# EAGLE design RTC-Module (EAGLE 7.7.0)
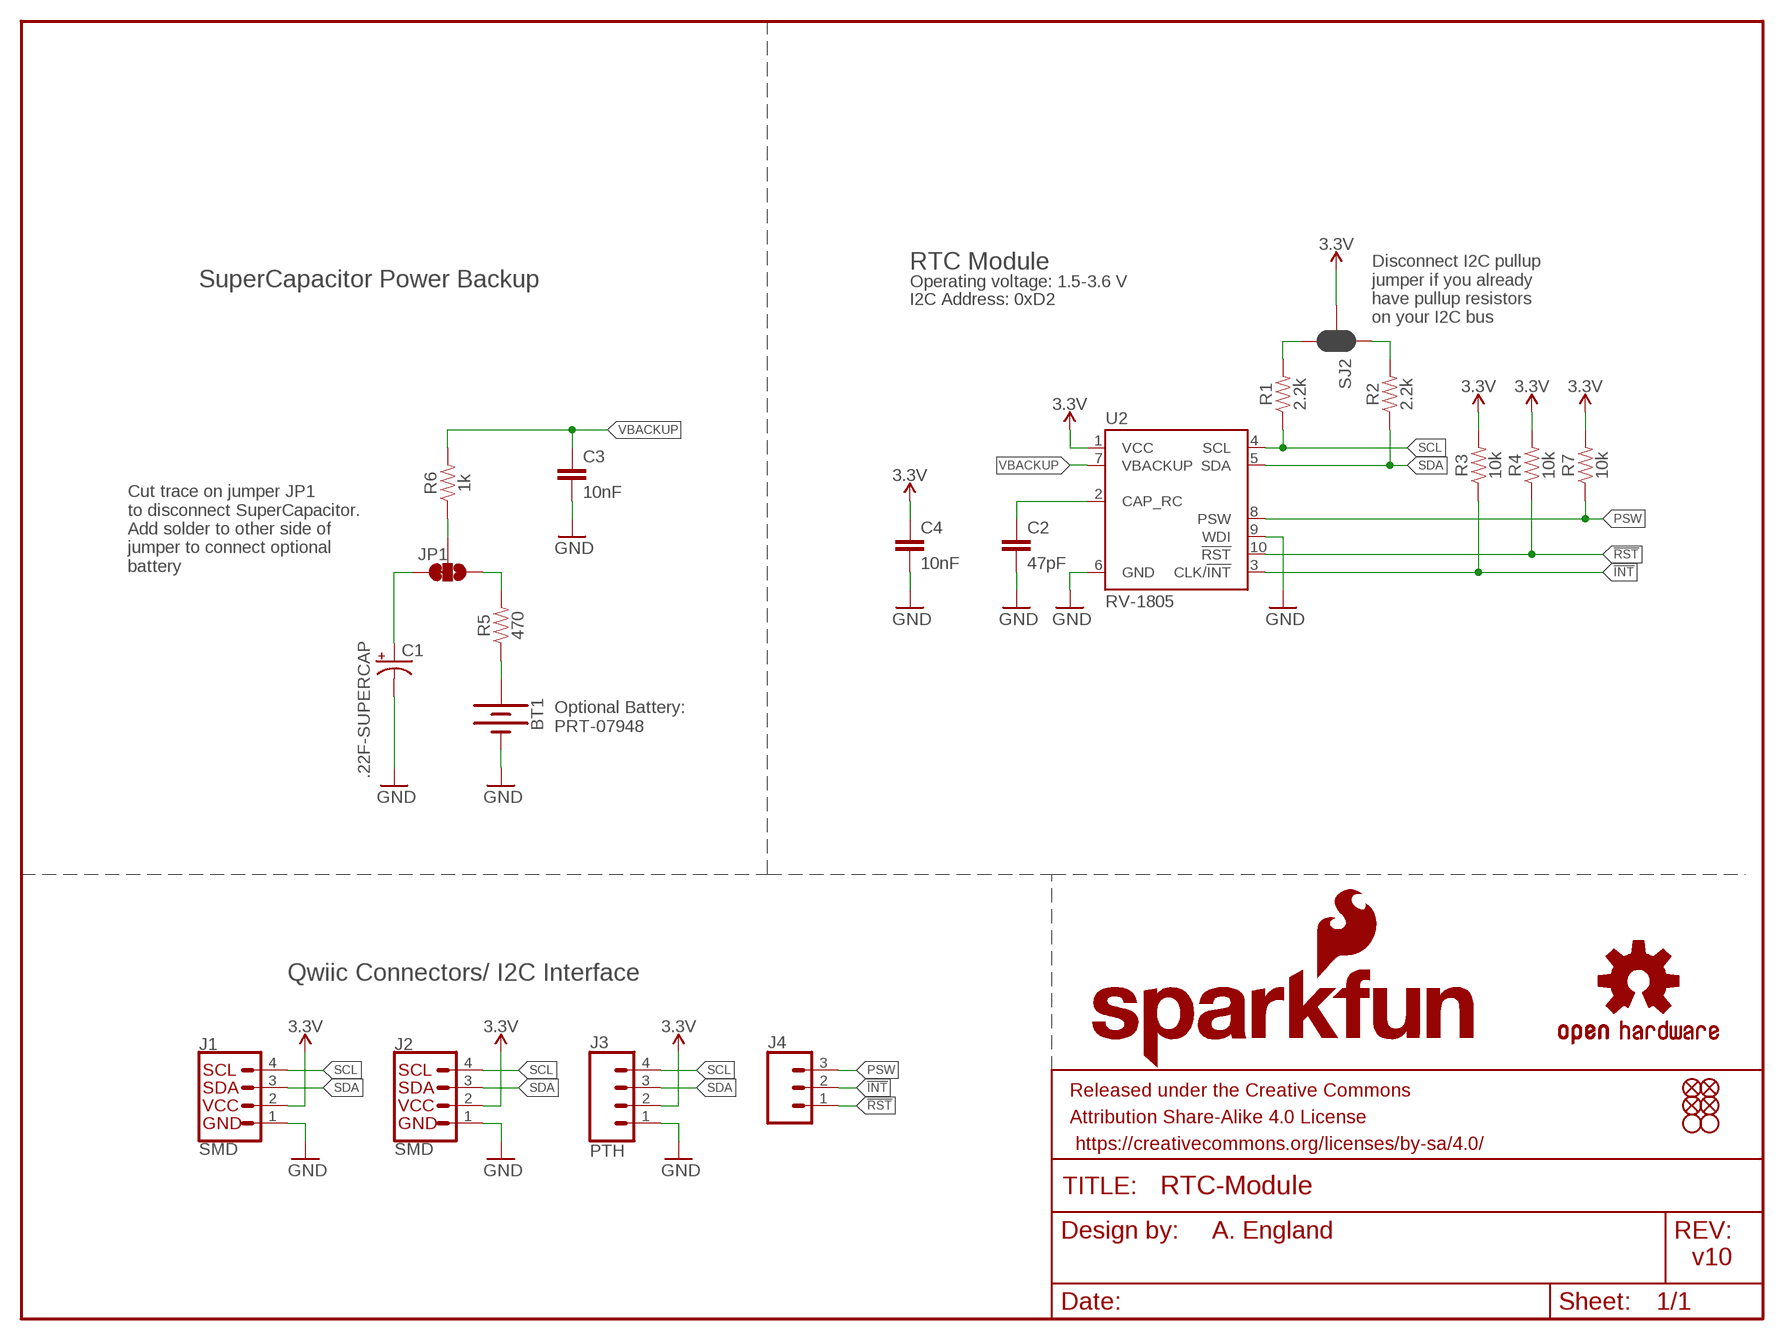
[diagram p0: schematic, sheet 1]

## Parts
BT1  BATTERY-12MM_PTH  [BATTCON_12MM_PTH]
C1  .22F-SUPERCAP  [DSK-RADIAL-6.8MM]
C2  47pF  47PF-0603-50V-5%  [0603]
C3  10nF  10NF-0603-50V-10%  [0603]
C4  10nF  10NF-0603-50V-10%  [0603]
FD1  FIDUCIALUFIDUCIAL  [FIDUCIAL-MICRO]
FD2  FIDUCIALUFIDUCIAL  [FIDUCIAL-MICRO]
FD3  FIDUCIALUFIDUCIAL  [FIDUCIAL-MICRO]
FD4  FIDUCIALUFIDUCIAL  [FIDUCIAL-MICRO]
FRAME2  FRAME-LETTER  [CREATIVE_COMMONS]
J1  SMD  QWIIC_CONNECTORJS-1MM  [1X04_1MM_RA]
J2  SMD  QWIIC_CONNECTORJS-1MM  [1X04_1MM_RA]
J3  PTH  CONN_041X04_NO_SILK  [1X04_NO_SILK]
J4  CONN_031X03_NO_SILK  [1X03_NO_SILK]
JP1  JUMPER-SMT_3_1-NC_TRACE_NO-SILK  [SMT-JUMPER_3_1-NC_TRACE_NO-SILK]
LOGO1  OSHW-LOGOS  [OSHW-LOGO-S]
LOGO2  SFE_LOGO_NAME_FLAME.1_INCH  [SFE_LOGO_NAME_FLAME_.1]
LOGO3  SFE_LOGO_NAME_FLAME.1_INCH  [SFE_LOGO_NAME_FLAME_.1]
R1  2.2k  2.2KOHM-0603-1/10W-1%  [0603]
R2  2.2k  2.2KOHM-0603-1/10W-1%  [0603]
R3  10k  10KOHM-0603-1/10W-1%  [0603]
R4  10k  10KOHM-0603-1/10W-1%  [0603]
R5  470  470OHM-0603-1/10W-1%  [0603]
R6  1k  1KOHM-0603-1/10W-1%  [0603]
R7  10k  10KOHM-0603-1/10W-1%  [0603]
SJ2  JUMPER-SMT_3_2-NC_PASTE_SILK  [SMT-JUMPER_3_2-NC_PASTE_SILK]
U2  RV-1805  [RV-1805]
U$6  STAND-OFF  [STAND-OFF]
U$7  STAND-OFF  [STAND-OFF]

## Nets
3.3V: C4.1 J1.2 J2.2 J3.2 R3.2 R4.2 R7.2 SJ2.2 U2.1(VCC)
!INT: J4.2 R3.1 U2.3(CLK/!INT)
!RST: J4.1 R4.1 U2.10(!RST)
GND: BT1.GND(-) C1.- C2.2 C3.2 C4.2 J1.1 J2.1 J3.1 U2.6(GND) U2.9(WDI)
N$1: R1.2 SJ2.3
N$2: R2.2 SJ2.1
N$3: BT1.VCC@1(+) R5.1
N$4: C2.1 U2.2(CAP_RC)
N$5: JP1.2 R6.1
N$6: C1.+ JP1.3
N$7: JP1.1 R5.2
PSW: J4.3 R7.1 U2.8(PSW)
SCL: J1.4 J2.4 J3.4 R1.1 U2.4(SCL)
SDA: J1.3 J2.3 J3.3 R2.1 U2.5(SDA)
VBACKUP: C3.1 R6.2 U2.7(VBACKUP)

## Notes on the sheet
- RTC Module
- SuperCapacitor Power Backup | Operating voltage: 1.5-3.6 V
- I2C Address: 0xD2
- Disconnect I2C pullup 
  jumper if you already 
  have pullup resistors 
  on your I2C bus
- Cut trace on jumper JP1 
  to disconnect SuperCapacitor.
  Add solder to other side of 
  jumper to connect optional
  battery
- Optional Battery: 
  PRT-07948
- Qwiic Connectors/ I2C Interface
- A. England
- v10

## Library data of the parts
BT1 = Andy:BATTERY: Battery - Single Cell A variety of battery chemistries, sizes, and footprints. Device List: 20MM_PTH - Coin Cell Battery Holder - 20mm (PTH) <https://www.sparkfun.com/products/783> 6.8MM_PTH - Coin Cell Battery Holder - 6.8MM(SMD) <https://www.digikey.com/product-detail/en/seiko-instruments/MS621FE-FL11E/728-1057-ND/1889208?WT.srch=1&gclid=CNOQ5a6LzdQCFZS2wAodXCkE0g> 12MM_SMD - Coin Cell Battery Holder - 12mm (SMD) <https://www.sparkfun.com/products/10592> 12MM_PTH - Coin Cell Battery Holder - 12mm (PTH) <https://www.sparkfun.com/products/7948> 20MM_SMD - 20mm Coin Cell Battery Holder (SMD) (2 legs) Used on the Big Time Watch Kit <https://www.sparkfun.com/products/11734> 20MM_SMD_4LEGS - Coin Cell Battery Holder - 20mm (SMD) <https://www.sparkfun.com/products/11892> 20MM_SMD_4LEGS_OVERPASTE - Coin Cell Battery Holder - 20mm (SMD) <https://www.sparkfun.com/products/11892> (Over-paste on the legs) 24.5MM_PTH - Coin Cell Battery Holder - 24.5mm (PTH) <https://www.sparkfun.com/products/8863> 9V - 9V Battery Holder - PC Mount Used on the SparkFun SparkPunk Sound Kit <https://www.sparkfun.com/products/11177> and SparkFun SparkPunk Sequencer Kit <https://www.sparkfun.com/products/12707> 18650 - Battery Holder - 18650 (PTH) <https://www.sparkfun.com/products/13113> AA - Battery Holder - 1xAA (PTH) <https://www.sparkfun.com/products/7949> AAA - Battery Holder - 1xAAA (PTH) <https://www.sparkfun.com/products/12718> AA_KIT - Battery Holder - 1xAA (PTH) <https://www.sparkfun.com/products/7949> Special kit package - pads only have exposed copper on one side of the board. AAA_KIT - Battery Holder - 1xAAA (PTH) <https://www.sparkfun.com/products/12718> Special kit package - pads only have exposed copper on one side of the board.; PROD_ID: BATT-08315; SF_SKU: PRT-07948
C1 = SparkFun-Capacitors:.22F-SUPERCAP: ELNA DSK-621 - 220mF Electric Double Layer Capacitor (EDLC/SuperCapacitor) A 220 mF SuperCapacitor. Used for backup power on devices with low standby current; PROD_ID: CAP-13907
C2 = SparkFun-Capacitors:47PF: 47pF ceramic capacitors A capacitor is a passive two-terminal electrical component used to store electrical energy temporarily in an electric field.; PROD_ID: CAP-08913
C3 C4 = SparkFun-Capacitors:10NF: 0.01uF/10nF/10,000pF ceramic capacitors A capacitor is a passive two-terminal electrical component used to store electrical energy temporarily in an electric field. CAP-09321; PROD_ID: CAP-00867
FD1-FD4 = SparkFun-Aesthetics:FIDUCIAL: Fiducial Alignment Points Point-of-reference for pick-and-place machines and other optical instruments.
FRAME2 = SparkFun-Aesthetics:FRAME-LETTER: Schematic Frame - Letter Standard 8.5x11 US Letter frame
J1 J2 = SparkFun-Connectors:QWIIC_CONNECTOR: SparkFun I2C Standard Qwiic Connector An SMD 1mm pitch JST connector makes it easy and quick (get it? Qwiic?) to connect I2C devices to each other. The Qwiic system <http://www.sparkfun.com/qwiic> enables fast and solderless connection between popular platforms and various sensors and actuators. We carry 200mm <https://www.sparkfun.com/products/14204>, 100mm <https://www.sparkfun.com/products/14205>, 50mm <https://www.sparkfun.com/products/14206>, and breadboard friendly <https://www.sparkfun.com/products/14207> Qwiic cables. We also offer 10 pcs strips <https://www.sparkfun.com/products/14323> the SMD connectors.; PROD_ID: CONN-13694
J3 = SparkFun-Connectors:CONN_04: Multi connection point. Often used as Generic Header-pin footprint for 0.1 inch spaced/style header connections On any of the 0.1 inch spaced packages, you can populate with these: Break Away Headers - Straight <https://www.sparkfun.com/products/116> (PRT-00116) Break Away Male Headers - Right Angle <https://www.sparkfun.com/products/553> (PRT-00553) Female Headers <https://www.sparkfun.com/products/115> (PRT-00115) Break Away Headers - Machine Pin <https://www.sparkfun.com/products/117> (PRT-00117) Break Away Female Headers - Swiss Machine Pin <https://www.sparkfun.com/products/743> (PRT-00743) For SCREWTERMINALS and SPRING TERMINALS visit here: Screw Terimnals on SparkFun.com <https://www.sparkfun.com/search/results?term=Screw+Terminals> (5mm/3.5mm/2.54mm spacing) This device is also useful as a general connection point to wire up your design to another part of your project. Our various solder wires solder well into these plated through hole pads. Hook-Up Wire - Assortment (Stranded, 22 AWG) <https://www.sparkfun.com/products/11375> (PRT-11375) Hook-Up Wire - Assortment (Solid Core, 22 AWG) <https://www.sparkfun.com/products/11367> (PRT-11367) View the entire wire category on our website here <https://www.sparkfun.com/categories/141> Special notes: Molex polarized connector foot print use with SKU : PRT-08231 with associated crimp pins and housings. 1MM SMD Version SKU: PRT-10208; PROD_ID: CONN-09696
J4 = SparkFun-Connectors:CONN_03: Multi connection point. Often used as Generic Header-pin footprint for 0.1 inch spaced/style header connections On any of the 0.1 inch spaced packages, you can populate with these: Break Away Headers - Straight <https://www.sparkfun.com/products/116> (PRT-00116) Break Away Male Headers - Right Angle <https://www.sparkfun.com/products/553> (PRT-00553) Female Headers <https://www.sparkfun.com/products/115> (PRT-00115) Break Away Headers - Machine Pin <https://www.sparkfun.com/products/117> (PRT-00117) Break Away Female Headers - Swiss Machine Pin <https://www.sparkfun.com/products/743> (PRT-00743) Stackable Header - 3 Pin (Female, 0.1") <https://www.sparkfun.com/products/13875> (PRT-13875) For SCREWTERMINALS and SPRING TERMINALS visit here: Screw Terimnals on SparkFun.com <https://www.sparkfun.com/search/results?term=Screw+Terminals> (5mm/3.5mm/2.54mm spacing) This device is also useful as a general connection point to wire up your design to another part of your project. Our various solder wires solder well into these plated through hole pads. Hook-Up Wire - Assortment (Stranded, 22 AWG) <https://www.sparkfun.com/products/11375> (PRT-11375) Hook-Up Wire - Assortment (Solid Core, 22 AWG) <https://www.sparkfun.com/products/11367> (PRT-11367) View the entire wire category on our website here <https://www.sparkfun.com/categories/141> Special notes: Molex polarized connector foot print use with SKU : PRT-08232 with associated crimp pins and housings.
JP1 = SparkFun-Jumpers:JUMPER-SMT_3_1-NC_TRACE: Normally closed trace jumper (1 of 2 connections) This jumper has a trace between two pads so it's normally closed (NC). The other connection is normally open (NO). Use a razor knife to open the connection. For best results follow the IPC guidelines for cutting traces: Cutout at least 0.063 mm (0.005 in). Remove all loose material to clean up the cut area. Seal the cut with an approved epoxy. Reapply solder to reclose the connection, or to close the NO connection.
LOGO1 = SparkFun-Aesthetics:OSHW-LOGO: Open Source Hardware Logo This logo indicates the piece of hardware it is found on incorporates a OSHW license and/or adheres to the definition of open source hardware found here: http://freedomdefined.org/OSHW
LOGO2 LOGO3 = SparkFun-Aesthetics:SFE_LOGO_NAME_FLAME: SparkFun Font Logo w/ Flame This is the SparkFun full logo. The logo on the schematic will always be the same size; the package variant is the height of the flame part of the logo. Default layer for the logo on the board is tSilk.
R1 R2 = SparkFun-Resistors:2.2KOHM: 2.2kΩ resistor A resistor is a passive two-terminal electrical component that implements electrical resistance as a circuit element. Resistors act to reduce current flow, and, at the same time, act to lower voltage levels within circuits. - Wikipedia; PROD_ID: RES-08272
R3 R4 R7 = SparkFun-Resistors:10KOHM: 10kΩ resistor A resistor is a passive two-terminal electrical component that implements electrical resistance as a circuit element. Resistors act to reduce current flow, and, at the same time, act to lower voltage levels within circuits. - Wikipedia; PROD_ID: RES-00824
R5 = SparkFun-Resistors:470OHM: 470Ω resistor A resistor is a passive two-terminal electrical component that implements electrical resistance as a circuit element. Resistors act to reduce current flow, and, at the same time, act to lower voltage levels within circuits. - Wikipedia; PROD_ID: RES-07869
R6 = SparkFun-Resistors:1KOHM: 1kΩ resistor A resistor is a passive two-terminal electrical component that implements electrical resistance as a circuit element. Resistors act to reduce current flow, and, at the same time, act to lower voltage levels within circuits. - Wikipedia; PROD_ID: RES-07856
SJ2 = SparkFun-Jumpers:JUMPER-SMT_3_2-NC_PASTE: Normally closed solder jumper (2 of 2 connections) This jumper has an aperture in the stencil to allow solder paste to bridge both connections. Both connections are normally closed (NC). Wick off the solder to open the connection(s). Reapply solder to reclose the connection(s).
U2 = SparkFun-Clocks:RV-1805: Micro Crystal Switzerland - RV-1805-C3 - Extremely low power RTC module This RTC IC has been specially designed for ultimate low current consumption of typically 60 nA @ VDD 3.0V for 32.768 kHz XTAL mode. Additionally, there is an RC-Mode consuming only 17nA and an autocalibrated RC-mode consuming 22nA which permits to operate this RTC module several hours at Backup Supply Voltage using low-cost MLCC. The very small SMT ceramic-package combines the 32.768 kHz crystal unit with the CMOS-based oscillator and real-time-clock IC.; PROD_ID: IC-13900
U$6 U$7 = SparkFun:STAND-OFF: Stand Off This is the mechanical footprint for a #4 phillips button head screw. Use the keepout ring to avoid running the screw head into surrounding components. SKU : PRT-00447

## Board
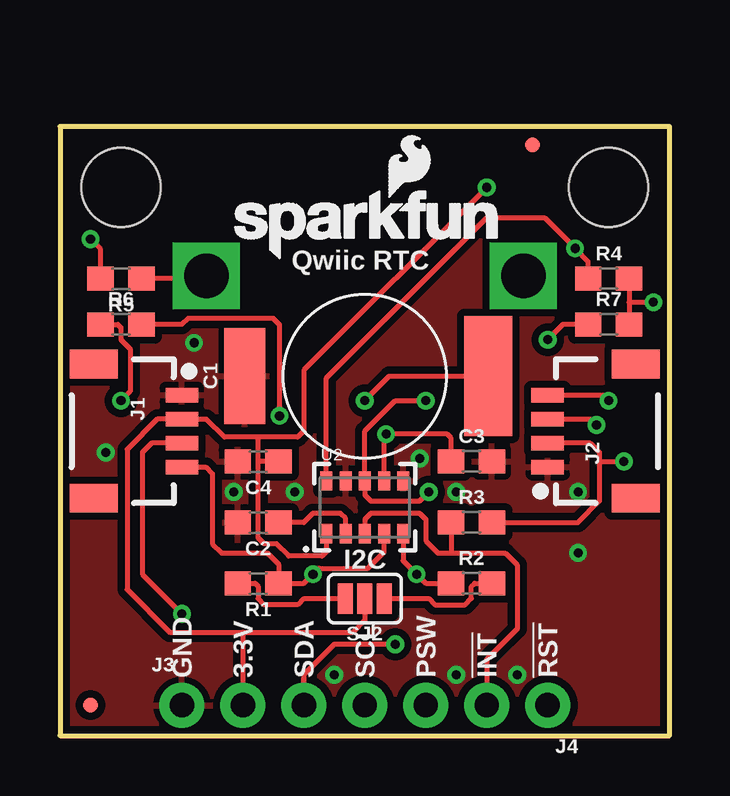
[diagram p1: board, top side]
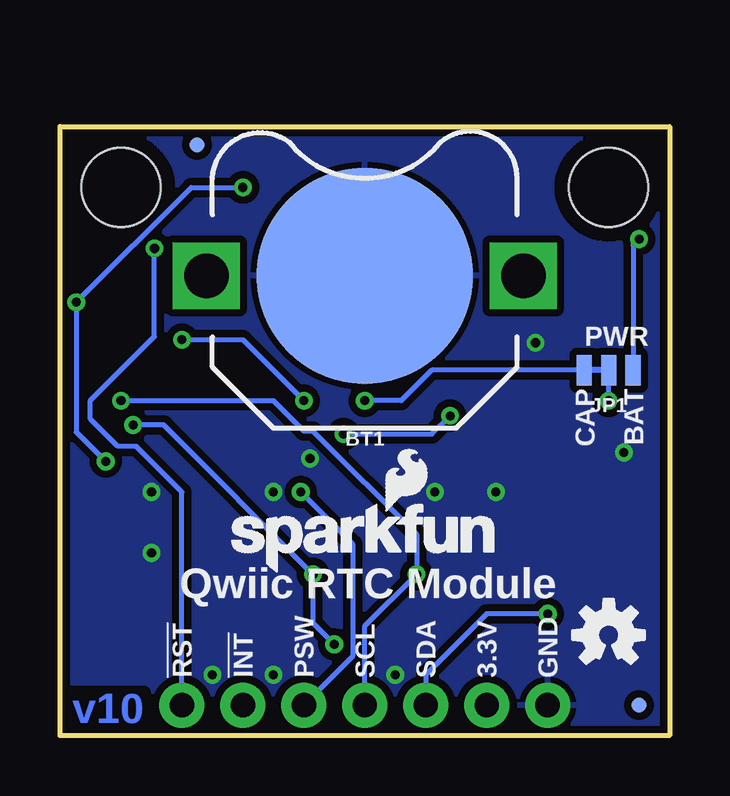
[diagram p2: board, bottom side, seen from below]

Size 25.4 x 25.4 mm. Coordinates in mm from the lower left corner, seen from the top.
Outline: 25.4,25.4 0,25.4 0,0 25.4,0 25.4,25.4
Copper layers (1*16): Top 0.035mm / dielectric 1.5mm / Bottom 0.035mm
Design rules "SparkFun-2-layer-TIGHT": minimum track width 7mil, minimum drill 15mil, track to track 7mil, track to pad 7mil, pad to pad 7mil, via to via 7mil, smd to smd 7mil, copper to edge 7mil, drill to drill 7mil, minimum pad ring 7mil, minimum via ring 7mil, stop-mask expansion 4mil, vias tented up to drill 25mil, thermal gap 10mil

### Footprints (pad centres in the part's own frame; a part is rotated, then mirrored left to right if it is on the bottom)
BATTCON_12MM_PTH = smd 9 x 9: GND 0,0 | drill 1.854 square: VCC@1 6.604,0; VCC@2 -6.604,0
DSK-RADIAL-6.8MM = smd 5 x 2: + 0,5.15 | smd 4 x 1.7: - 0,-5
0603 = smd 1.1 x 1: 1 -0.85,0; 2 0.85,0
FIDUCIAL-MICRO = smd 0.635 x 0.635: 1 0,0
1X04_1MM_RA = smd 0.6 x 1.35: 1 -1.5,0; 2 -0.5,0; 3 0.5,0; 4 1.5,0 | smd 1.2 x 2: NC1 2.8,-3.675; NC2 -2.8,-3.675
1X04_NO_SILK = drill 1.016 pad 1.88: 1 0,0; 2 2.54,0; 3 5.08,0; 4 7.62,0
1X03_NO_SILK = drill 1.016 pad 1.88: 1 0,0; 2 2.54,0; 3 5.08,0
SMT-JUMPER_3_1-NC_TRACE_NO-SILK = smd 0.635 x 1.27: 1 -1.016,0; 2 0,0; 3 1.016,0
SMT-JUMPER_3_2-NC_PASTE_SILK = smd 0.635 x 1.27: 1 -0.813,0; 2 0,0; 3 0.813,0
RV-1805 = smd 0.5 x 0.8: 1 -1.6,-1.1; 2 -0.8,-1.1; 3 0,-1.1; 4 0.8,-1.1; 5 1.6,-1.1; 6 1.6,1.1; 7 0.8,1.1; 8 0,1.1; 9 -0.8,1.1; 10 -1.6,1.1 | smd 0 x 0: 11 0,0
STAND-OFF = hole 3.302: 0,0

### Placement (x,y rotation side)
BT1  12.7,19.18 0 bottom
C1  12.7,14.99 270 top
C2  8.26,8.89 180 top
C3  17.14,11.43 0 top
C4  8.26,11.43 180 top
FD1  19.68,24.64 0 bottom
FD2  19.68,24.64 0 top
FD3  1.27,1.27 0 bottom
FD4  1.27,1.27 0 top
FRAME2  -12.7,-8.89 0 top  (outside the outline)
J1  5.08,12.7 270 top
J2  20.32,12.7 90 top
J3  5.08,1.27 0 top
J4  20.32,1.27 180 top
JP1  2.54,15.24 180 bottom
LOGO1  2.54,4.19 0 bottom
LOGO2  6.86,19.81 0 top
LOGO3  18.67,6.73 0 bottom
R1  8.26,6.35 180 top
R2  17.14,6.35 0 top
R3  17.14,8.89 0 top
R4  22.86,19.05 0 top
R5  2.54,19.05 180 top
R6  2.54,17.14 0 top
R7  22.86,17.14 0 top
SJ2  12.7,5.71 180 top
U2  12.7,9.53 0 top
U$6  22.86,22.86 180 top
U$7  2.54,22.86 180 top

### Tracks (layer width: path | path; a pad name or v marks a point on that pad's centre or on a via)
3.3V  (via drill 0.38)
  Top 0.203: SJ2.2 12.7,4.83 12.19,4.32 7.62,4.32 | 7.62,4.32 J3.2 | J2.2 22.09,12.2 22.48,11.81 22.48,11.43 | R4.2 23.71,18.07 | 23.71,18.07 R7.2 | 23.71,18.07 v24.73,18.07 | 22.48,11.43 v23.5,11.43 | 7.62,4.32 4.57,4.32 2.79,6.1 2.79,11.94 4.06,13.2 J1.2 6.1,13.2 6.86,12.45 8.26,12.45 | U2.1 11.1,7.67 10.92,7.49 9.53,7.49 9.02,8 8.51,8 8.26,8.26 8.26,11.43 | 8.26,11.43 8.26,12.45 | C4.1 8.26,11.43 | v17.78,22.86 10.16,15.24 10.16,12.7 9.91,12.45 8.26,12.45 | R3.2 21.59,8.89 22.48,9.78 22.48,11.43
  Bottom 0.203: v23.5,11.43 24.73,12.66 v24.73,18.07 19.94,22.86 v17.78,22.86
!INT
  Top 0.203: J4.2 17.78,3.17 19.05,4.45 19.05,7.11 18.54,7.62 16.3,7.62 | U2.3 12.7,9.02 12.95,9.27 14.99,9.27 15.24,9.02 15.24,8.13 15.75,7.62 16.3,7.62 | R3.1 16.3,7.62
!RST  (via drill 0.38)
  Top 0.203: U2.10 11.1,14.91 17.78,21.59 20.19,21.59 v21.46,20.32 22.01,19.77 R4.1
  Bottom 0.203: J4.1 20.32,10.16 22.23,12.06 22.99,12.06 24.13,13.21 24.13,13.97 21.46,16.64 v21.46,20.32
GND  (via drill 0.38)
  other vias: 7.24,10.16 5.59,16.38 1.91,11.81 9.78,10.16 14.99,11.56 16.51,10.16 21.59,10.16 21.59,7.62 19.05,2.54 16.51,2.54 11.43,2.54
  pour Top (isolate 0.305): 0,25.4 25.4,25.4 25.4,0 0,0
  pour Bottom (isolate 0.305): 25.4,25.4 0,25.4 0,0 25.4,0
N$1
  Top 0.203: R1.2 8.13,6.35 8.26,6.22 8.26,5.71 8.51,5.46 9.91,5.46 10.16,5.71 SJ2.3
N$2
  Top 0.203: SJ2.1 15.37,5.71 15.62,5.46 16.89,5.46 17.14,5.71 17.14,6.22 17.27,6.35 R2.2
N$3
  Top 0.203: BT1.VCC@1 5.97,19.05 R5.1
N$4
  Top 0.203: U2.2 11.9,9.05 11.68,9.27 10.54,9.27 10.16,8.89 C2.1
N$5  (via drill 0.38)
  Top 0.203: R6.1 2.41,17.14 2.54,17.02 2.54,16.51 2.92,16.13 2.92,14.35 v2.54,13.97
  Bottom 0.203: v2.54,13.97 JP1.2
N$6  (via drill 0.38)
  Top 0.203: v12.7,13.97 13.72,14.99 C1.+
  Bottom 0.203: JP1.3 9.91,15.24 11.18,13.97 v12.7,13.97
N$7  (via drill 0.38)
  Top 0.203: R5.2 1.69,20.28 v1.27,20.7
  Bottom 0.203: v1.27,20.7 1.52,20.45 JP1.1
PSW  (via drill 0.38)
  Top 0.203: R7.1 20.95,17.14 v20.32,16.51 | v15.37,10.16 14.99,9.78 12.95,9.78 12.7,10.03 U2.8 12.7,12.7 13.97,13.97 v15.24,13.97
  Bottom 0.203: v20.32,16.51 17.78,16.51 v15.24,13.97 | J4.3 13.21,3.3 13.21,8 v15.37,10.16
SCL  (via drill 0.38)
  Top 0.203: U2.4 13.5,7.66 12.83,6.99 10.79,6.99 v10.54,6.73 10.16,6.35 R1.1 9.11,7.15 8.64,7.62 6.73,7.62 6.35,8 6.35,10.92 6.07,11.2 J1.4 | J2.4 22.63,14.2 v22.86,13.97
  Bottom 0.203: J3.4 12.7,4.57 v10.54,6.73 10.54,8.38 14.86,12.7 15.24,12.7 16.51,13.97 v22.86,13.97
SDA  (via drill 0.38)
  Top 0.203: U2.5 14.3,7.29 v14.86,6.73 15.24,6.35 R2.1 | 10.16,2.41 J3.3 10.16,2.54 11.43,3.81 v13.97,3.81 | J2.3 22.11,13.2 v22.35,12.95 | J1.3 3.82,12.2 3.43,11.81 3.43,6.73 v5.08,5.08
  Bottom 0.203: v13.97,3.81 14.86,4.7 v14.86,6.73 21.08,12.95 v22.35,12.95 | v5.08,5.08 7.62,5.08 10.16,2.54 J3.3 10.16,2.41
VBACKUP  (via drill 0.38)
  Top 0.203: R6.2 5.08,17.14 5.33,17.4 8.89,17.4 9.14,17.14 v9.14,13.34 | U2.7 13.5,12.48 v13.59,12.57 16.13,12.57 16.3,12.41 C3.1
  Bottom 0.203: v13.59,12.57 9.91,12.57 v9.14,13.34

### Text on the board
Bottom: v10
tPlace: Qwiic RTC | I2C | GND | 3.3V | SDA | SCL | PSW | !INT | !RST
bPlace: PWR | BAT | CAP | Qwiic RTC Module | GND | 3.3V | SDA | SCL | PSW | !INT | !RST
Measures: Units in Inches
tDocu: Andy England